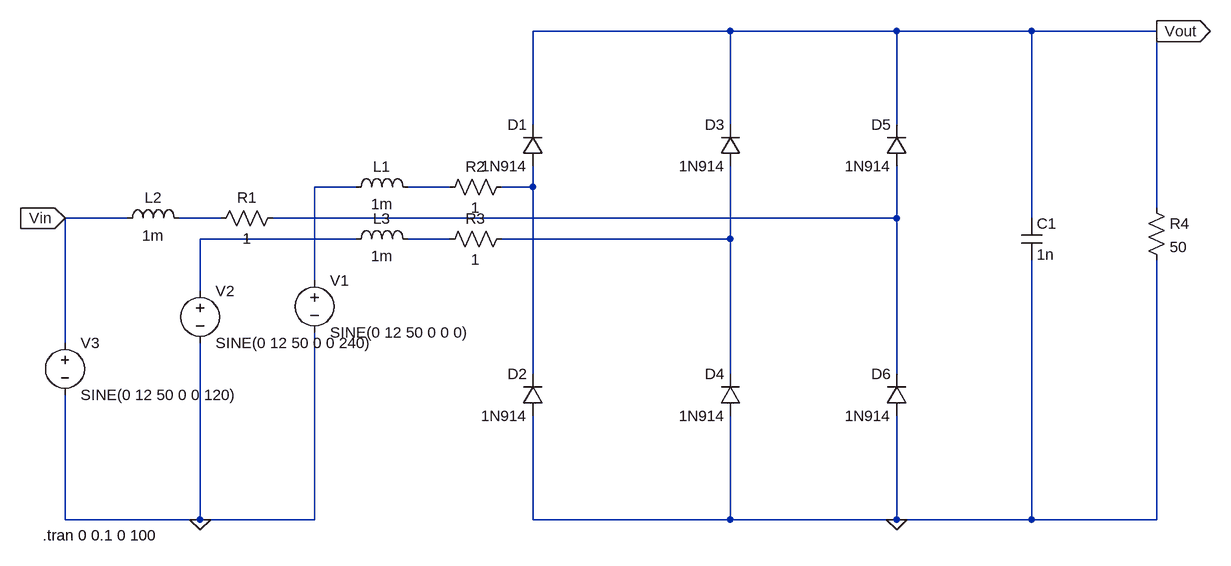
[diagram p0: schematic Draft2.asc]
Draft2.asc, the LTspice schematic file:
Version 4
SHEET 1 1232 680
WIRE 464 -208 160 -208
WIRE 720 -208 464 -208
WIRE 928 -208 720 -208
WIRE 1120 -208 928 -208
WIRE 160 -64 160 -208
WIRE 464 -64 464 -208
WIRE 720 -64 720 -208
WIRE -112 32 -176 32
WIRE 32 32 -32 32
WIRE 160 32 160 0
WIRE 160 32 112 32
WIRE 1120 64 1120 -208
WIRE -464 80 -560 80
WIRE -320 80 -384 80
WIRE 720 80 720 0
WIRE 720 80 -240 80
WIRE 928 80 928 -208
WIRE -112 112 -352 112
WIRE 32 112 -32 112
WIRE 464 112 464 0
WIRE 464 112 112 112
WIRE -176 176 -176 32
WIRE -352 192 -352 112
WIRE -560 272 -560 80
WIRE 160 320 160 32
WIRE 464 320 464 112
WIRE 720 320 720 80
WIRE -560 544 -560 352
WIRE -352 544 -352 272
WIRE -352 544 -560 544
WIRE -176 544 -176 256
WIRE -176 544 -352 544
WIRE 160 544 160 384
WIRE 464 544 464 384
WIRE 464 544 160 544
WIRE 720 544 720 384
WIRE 720 544 464 544
WIRE 928 544 928 144
WIRE 928 544 720 544
WIRE 1120 544 1120 144
WIRE 1120 544 928 544
FLAG -352 544 0
FLAG 720 544 0
FLAG 1120 -208 Vout
IOPIN 1120 -208 Out
FLAG -560 80 Vin
IOPIN -560 80 In
SYMBOL voltage -176 160 R0
WINDOW 123 0 0 Left 0
WINDOW 39 0 0 Left 0
SYMATTR InstName V1
SYMATTR Value SINE(0 12 50 0 0 0)
SYMBOL diode 176 0 R180
WINDOW 0 24 64 Left 2
WINDOW 3 24 0 Left 2
SYMATTR InstName D1
SYMATTR Value 1N914
SYMBOL diode 176 384 R180
WINDOW 0 24 64 Left 2
WINDOW 3 24 0 Left 2
SYMATTR InstName D2
SYMATTR Value 1N914
SYMBOL diode 480 0 R180
WINDOW 0 24 64 Left 2
WINDOW 3 24 0 Left 2
SYMATTR InstName D3
SYMATTR Value 1N914
SYMBOL diode 480 384 R180
WINDOW 0 24 64 Left 2
WINDOW 3 24 0 Left 2
SYMATTR InstName D4
SYMATTR Value 1N914
SYMBOL ind -128 48 R270
WINDOW 0 32 56 VTop 2
WINDOW 3 5 56 VBottom 2
SYMATTR InstName L1
SYMATTR Value 1m
SYMBOL voltage -352 176 R0
WINDOW 123 0 0 Left 0
WINDOW 39 0 0 Left 0
SYMATTR InstName V2
SYMATTR Value SINE(0 12 50 0 0 240)
SYMBOL voltage -560 256 R0
WINDOW 123 0 0 Left 0
WINDOW 39 0 0 Left 0
SYMATTR InstName V3
SYMATTR Value SINE(0 12 50 0 0 120)
SYMBOL diode 736 0 R180
WINDOW 0 24 64 Left 2
WINDOW 3 24 0 Left 2
SYMATTR InstName D5
SYMATTR Value 1N914
SYMBOL diode 736 384 R180
WINDOW 0 24 64 Left 2
WINDOW 3 24 0 Left 2
SYMATTR InstName D6
SYMATTR Value 1N914
SYMBOL ind -480 96 R270
WINDOW 0 32 56 VTop 2
WINDOW 3 5 56 VBottom 2
SYMATTR InstName L2
SYMATTR Value 1m
SYMBOL ind -128 128 R270
WINDOW 0 32 56 VTop 2
WINDOW 3 5 56 VBottom 2
SYMATTR InstName L3
SYMATTR Value 1m
SYMBOL res -224 64 R90
WINDOW 0 0 56 VBottom 2
WINDOW 3 32 56 VTop 2
SYMATTR InstName R1
SYMATTR Value 1
SYMBOL res 128 16 R90
WINDOW 0 0 56 VBottom 2
WINDOW 3 32 56 VTop 2
SYMATTR InstName R2
SYMATTR Value 1
SYMBOL res 128 96 R90
WINDOW 0 0 56 VBottom 2
WINDOW 3 32 56 VTop 2
SYMATTR InstName R3
SYMATTR Value 1
SYMBOL cap 912 80 R0
SYMATTR InstName C1
SYMATTR Value 1n
SYMBOL res 1104 48 R0
SYMATTR InstName R4
SYMATTR Value 50
TEXT -594 568 Left 2 !.tran 0 0.1 0 100

The netlist it stands for:
* Draft2.asc
V1 N001 0 SINE(0 12 50 0 0 0)
D1 N003 Vout 1N914
D2 0 N003 1N914
D3 N008 Vout 1N914
D4 0 N008 1N914
L1 N001 N002 1m
V2 N006 0 SINE(0 12 50 0 0 240)
V3 Vin 0 SINE(0 12 50 0 0 120)
D5 N005 Vout 1N914
D6 0 N005 1N914
L2 Vin N004 1m
L3 N006 N007 1m
R1 N005 N004 1
R2 N003 N002 1
R3 N008 N007 1
C1 Vout 0 1n
R4 Vout 0 50
.model D D
.lib standard.dio
.tran 0 0.1 0 100
.backanno
.end